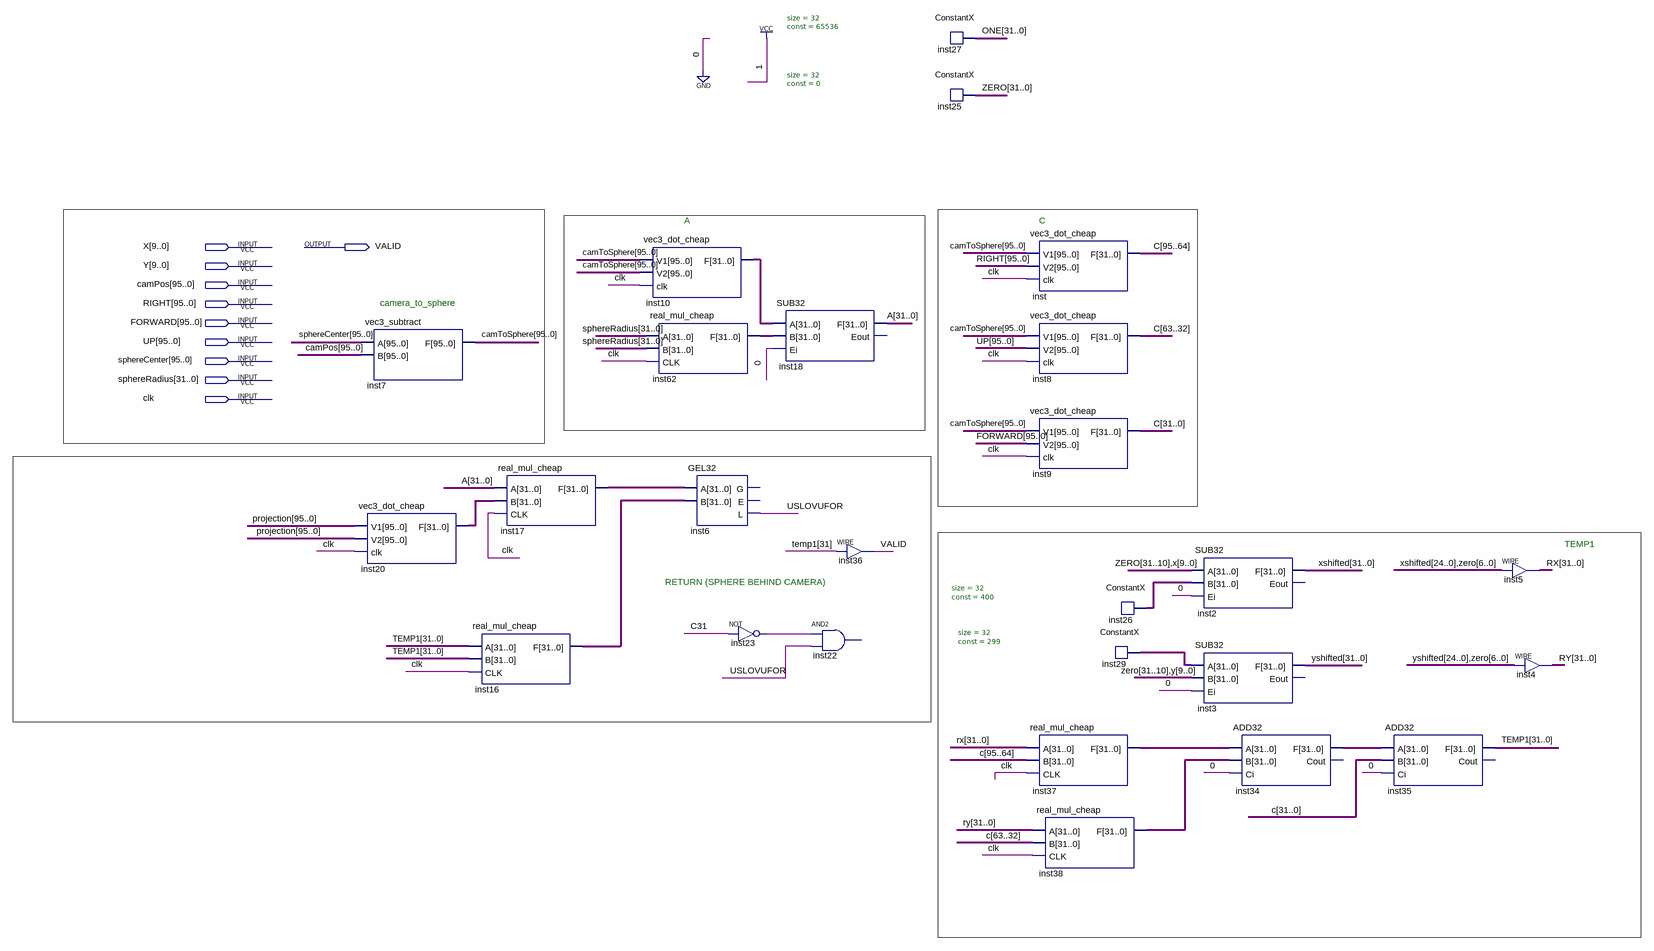
[diagram p0: schematic sheet]
// Quartus schematic layer_sphere1.bdf as structural Verilog: 26 symbols, 10 pins
module layer_sphere1 (
  input  [9:0] X,
  input  [9:0] Y,
  input  [95:0] camPos,
  input  [95:0] RIGHT,
  input  [95:0] FORWARD,
  input  [95:0] UP,
  input  [95:0] sphereCenter,
  input  [31:0] sphereRadius,
  input  clk,
  output VALID
);

  wire inst23_out, USLOVUFOR;
  wire [31:0] A, inst10_f, inst16_f, inst17_f, inst20_f, inst26_data_out, inst29_data_out, inst34_f,
       inst37_f, inst38_f, inst62_f, ONE, RX, RY, TEMP1, xshifted, yshifted, ZERO;
  wire [95:0] C, camToSphere, projection;

  vec3_subtract inst7 (.A(sphereCenter), .B(camPos), .F(camToSphere));
  vec3_dot_cheap inst20 (.V1(projection), .V2(projection), .clk(clk), .F(inst20_f));
  real_mul_cheap inst16 (.A(TEMP1), .B(TEMP1), .CLK(clk), .F(inst16_f));
  real_mul_cheap inst17 (.A(A), .B(inst20_f), .CLK(clk), .F(inst17_f));
  vec3_dot_cheap inst10 (.V1(camToSphere), .V2(camToSphere), .clk(clk), .F(inst10_f));
  real_mul_cheap inst62 (.A(sphereRadius), .B(sphereRadius), .CLK(clk), .F(inst62_f));
  GEL32 inst6 (.A(inst17_f), .B(inst16_f), .L(USLOVUFOR));  // open: G, E
  not inst23 (inst23_out, C[31]);
  SUB32 inst18 (.A(inst10_f), .B(inst62_f), .Ei(1'b0), .F(A));  // open: Eout
  // AND2 inst22 has open pins: IN1=inst23_out, IN2=USLOVUFOR, OUT=open
  assign VALID = TEMP1[31];  // WIRE inst36
  ConstantX #(.size(32), .\const (65536)) inst27 (.DATA_OUT(ONE));
  ConstantX #(.size(32), .\const (0)) inst25 (.DATA_OUT(ZERO));
  vec3_dot_cheap inst (.V1(camToSphere), .V2(RIGHT), .clk(clk), .F(C[95:64]));
  vec3_dot_cheap inst8 (.V1(camToSphere), .V2(UP), .clk(clk), .F(C[63:32]));
  vec3_dot_cheap inst9 (.V1(camToSphere), .V2(FORWARD), .clk(clk), .F(C[31:0]));
  real_mul_cheap inst37 (.A(RX), .B(C[95:64]), .CLK(clk), .F(inst37_f));
  real_mul_cheap inst38 (.A(RY), .B(C[63:32]), .CLK(clk), .F(inst38_f));
  ConstantX #(.size(32), .\const (400)) inst26 (.DATA_OUT(inst26_data_out));
  ConstantX #(.size(32), .\const (299)) inst29 (.DATA_OUT(inst29_data_out));
  SUB32 inst2 (.A({ZERO[31:10], X}), .B(inst26_data_out), .Ei(1'b0), .F(xshifted));  // open: Eout
  SUB32 inst3 (.A(inst29_data_out), .B({ZERO[31:10], Y}), .Ei(1'b0), .F(yshifted));  // open: Eout
  ADD32 inst34 (.A(inst37_f), .B(inst38_f), .Ci(1'b0), .F(inst34_f));  // open: Cout
  ADD32 inst35 (.A(inst34_f), .B(C[31:0]), .Ci(1'b0), .F(TEMP1));  // open: Cout
  assign RX = {xshifted[24:0], ZERO[6:0]};  // WIRE inst5
  assign RY = {yshifted[24:0], ZERO[6:0]};  // WIRE inst4

  // Notes on the sheet:
  //   A
  //   C
  //   camera_to_sphere
  //   TEMP1
  //   RETURN (SPHERE BEHIND CAMERA)
endmodule
